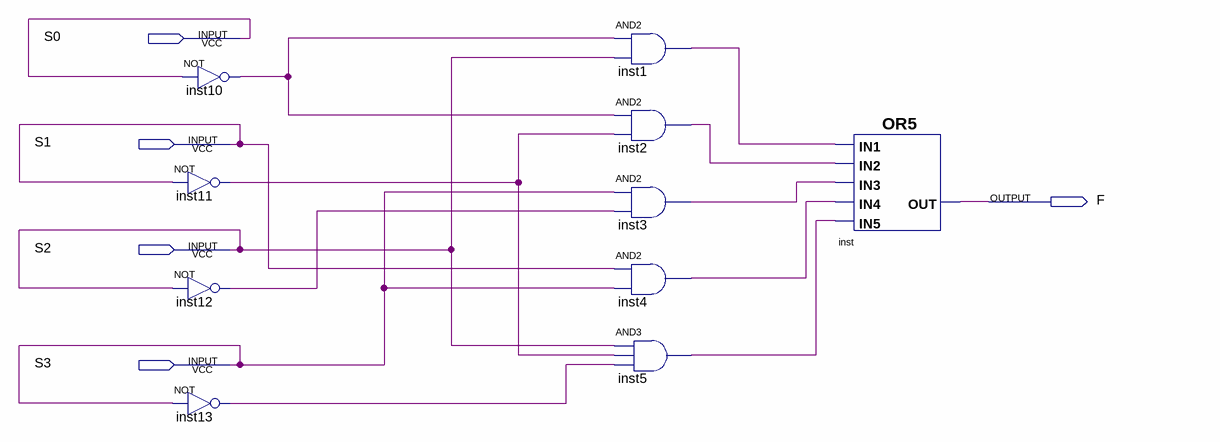
[diagram p0: schematic sheet]
// Quartus schematic F-nda2_3.bdf as structural Verilog: 10 symbols, 5 pins
module \F-nda2_3  (
  input  S0,
  input  S1,
  input  S2,
  input  S3,
  output F
);

  wire inst1_out, inst2_out, inst3_out, inst4_out, inst5_out, inst10_out, inst11_out, inst12_out, inst13_out;

  not inst10 (inst10_out, S0);
  not inst11 (inst11_out, S1);
  not inst12 (inst12_out, S2);
  not inst13 (inst13_out, S3);
  and inst1 (inst1_out, inst10_out, S2);
  and inst2 (inst2_out, inst10_out, inst11_out);
  and inst3 (inst3_out, S3, inst12_out);
  and inst4 (inst4_out, S1, S3);
  and inst5 (inst5_out, S2, inst11_out, inst13_out);
  or inst (F, inst1_out, inst2_out, inst3_out, inst4_out, inst5_out);
endmodule
